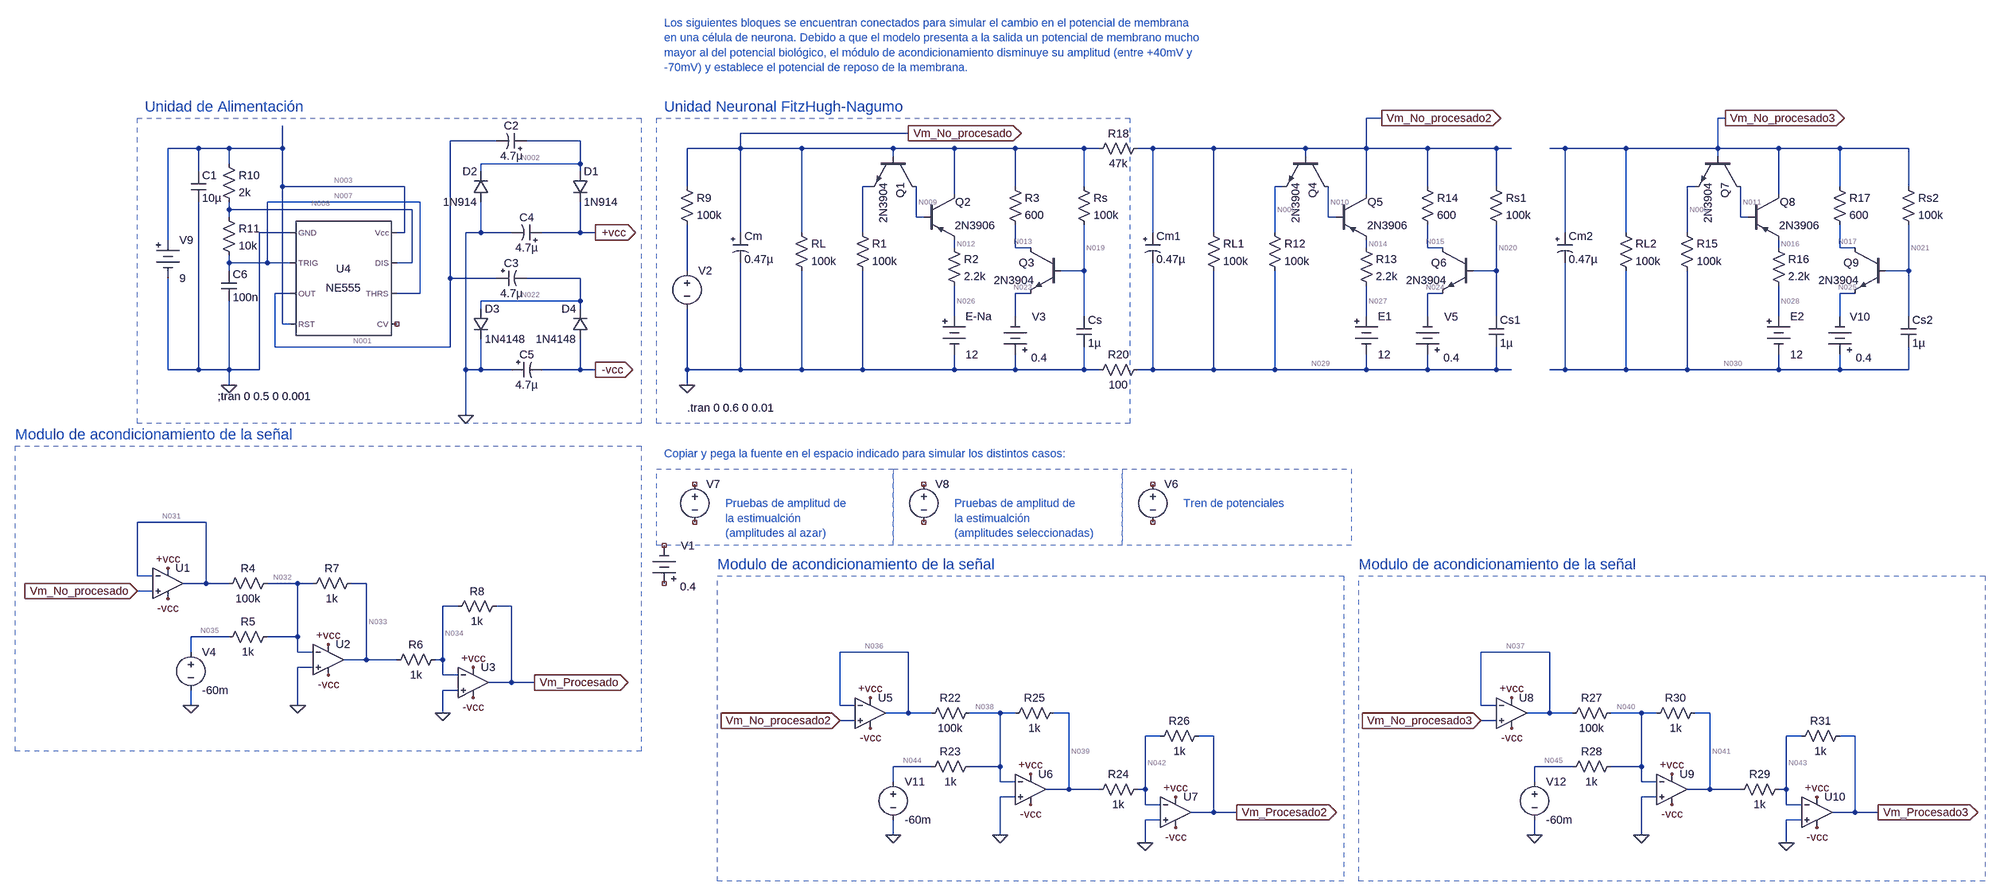
[diagram p0: schematic Pruebas etapas.asc]
Pruebas etapas.asc, the LTspice schematic file:
Version 4
SHEET 1 2580 1348
WIRE 1296 -256 1264 -256
WIRE 2016 -256 2000 -256
WIRE 304 -224 -48 -224
WIRE -560 -208 -656 -208
WIRE -384 -208 -496 -208
WIRE -1184 -192 -1248 -192
WIRE -1120 -192 -1184 -192
WIRE -1008 -192 -1008 -240
WIRE -1008 -192 -1120 -192
WIRE -48 -192 -48 -224
WIRE -48 -192 -160 -192
WIRE 80 -192 -48 -192
WIRE 272 -192 80 -192
WIRE 400 -192 272 -192
WIRE 528 -192 400 -192
WIRE 672 -192 528 -192
WIRE 704 -192 672 -192
WIRE 816 -192 784 -192
WIRE 944 -192 816 -192
WIRE 1136 -192 944 -192
WIRE 1264 -192 1264 -256
WIRE 1264 -192 1136 -192
WIRE 1392 -192 1264 -192
WIRE 1536 -192 1392 -192
WIRE 1568 -192 1536 -192
WIRE 1680 -192 1648 -192
WIRE 1808 -192 1680 -192
WIRE 2000 -192 2000 -256
WIRE 2000 -192 1808 -192
WIRE 2128 -192 2000 -192
WIRE 2256 -192 2128 -192
WIRE 2400 -192 2256 -192
WIRE 272 -176 272 -192
WIRE 1136 -176 1136 -192
WIRE 2000 -176 2000 -192
WIRE -1120 -160 -1120 -192
WIRE -384 -160 -384 -208
WIRE -384 -160 -592 -160
WIRE -1184 -144 -1184 -192
WIRE -592 -144 -592 -160
WIRE -384 -144 -384 -160
WIRE -1008 -112 -1008 -192
WIRE -752 -112 -1008 -112
WIRE -160 -112 -160 -192
WIRE 224 -112 208 -112
WIRE 528 -112 528 -192
WIRE 672 -112 672 -192
WIRE 1088 -112 1072 -112
WIRE 1392 -112 1392 -192
WIRE 1536 -112 1536 -192
WIRE 1952 -112 1936 -112
WIRE 2256 -112 2256 -192
WIRE 2400 -112 2400 -192
WIRE 400 -96 400 -192
WIRE 1264 -96 1264 -192
WIRE 2128 -96 2128 -192
WIRE -720 -80 -1040 -80
WIRE -1120 -64 -1120 -80
WIRE -736 -64 -1120 -64
WIRE -1120 -48 -1120 -64
WIRE 320 -48 320 -112
WIRE 336 -48 320 -48
WIRE 1184 -48 1184 -112
WIRE 1200 -48 1184 -48
WIRE 2048 -48 2048 -112
WIRE 2064 -48 2048 -48
WIRE -992 -16 -1056 -16
WIRE -752 -16 -752 -112
WIRE -752 -16 -768 -16
WIRE -592 -16 -592 -80
WIRE -592 -16 -624 -16
WIRE -528 -16 -592 -16
WIRE -384 -16 -384 -80
WIRE -384 -16 -464 -16
WIRE -352 -16 -384 -16
WIRE -48 -16 -48 -192
WIRE 80 -16 80 -192
WIRE 208 -16 208 -112
WIRE 816 -16 816 -192
WIRE 944 -16 944 -192
WIRE 1072 -16 1072 -112
WIRE 1680 -16 1680 -192
WIRE 1808 -16 1808 -192
WIRE 1936 -16 1936 -112
WIRE -1248 0 -1248 -192
WIRE 400 16 400 0
WIRE 528 16 528 -32
WIRE 560 16 528 16
WIRE 1264 16 1264 0
WIRE 1392 16 1392 -32
WIRE 1424 16 1392 16
WIRE 2128 16 2128 0
WIRE 2256 16 2256 -32
WIRE 2288 16 2256 16
WIRE -1120 48 -1120 32
WIRE -1040 48 -1040 -80
WIRE -1040 48 -1120 48
WIRE -992 48 -1040 48
WIRE -736 48 -736 -64
WIRE -736 48 -768 48
WIRE -1120 64 -1120 48
WIRE -160 64 -160 -32
WIRE 672 64 672 -32
WIRE 672 64 624 64
WIRE 1536 64 1536 -32
WIRE 1536 64 1488 64
WIRE 2400 64 2400 -32
WIRE 2400 64 2352 64
WIRE -656 80 -656 -208
WIRE -560 80 -656 80
WIRE -384 80 -496 80
WIRE -992 112 -1024 112
WIRE -720 112 -720 -80
WIRE -720 112 -768 112
WIRE 560 112 528 112
WIRE 1424 112 1392 112
WIRE 2288 112 2256 112
WIRE -384 128 -384 80
WIRE -384 128 -592 128
WIRE -592 144 -592 128
WIRE -384 144 -384 128
WIRE 400 160 400 96
WIRE 528 160 528 112
WIRE 672 160 672 64
WIRE 1264 160 1264 96
WIRE 1392 160 1392 112
WIRE 1536 160 1536 64
WIRE 2128 160 2128 96
WIRE 2256 160 2256 112
WIRE 2400 160 2400 64
WIRE -1008 176 -1008 -112
WIRE -992 176 -1008 176
WIRE -1024 224 -1024 112
WIRE -656 224 -656 80
WIRE -656 224 -1024 224
WIRE -1248 272 -1248 80
WIRE -1184 272 -1184 -80
WIRE -1184 272 -1248 272
WIRE -1120 272 -1120 128
WIRE -1120 272 -1184 272
WIRE -1056 272 -1056 -16
WIRE -1056 272 -1120 272
WIRE -624 272 -624 -16
WIRE -592 272 -592 208
WIRE -592 272 -624 272
WIRE -528 272 -592 272
WIRE -384 272 -384 208
WIRE -384 272 -464 272
WIRE -352 272 -384 272
WIRE -160 272 -160 144
WIRE -48 272 -48 48
WIRE -48 272 -160 272
WIRE 80 272 80 64
WIRE 80 272 -48 272
WIRE 208 272 208 64
WIRE 208 272 80 272
WIRE 400 272 400 240
WIRE 400 272 208 272
WIRE 528 272 528 240
WIRE 528 272 400 272
WIRE 672 272 672 224
WIRE 672 272 528 272
WIRE 704 272 672 272
WIRE 816 272 816 48
WIRE 816 272 784 272
WIRE 944 272 944 64
WIRE 944 272 816 272
WIRE 1072 272 1072 64
WIRE 1072 272 944 272
WIRE 1264 272 1264 240
WIRE 1264 272 1072 272
WIRE 1392 272 1392 240
WIRE 1392 272 1264 272
WIRE 1536 272 1536 224
WIRE 1536 272 1392 272
WIRE 1568 272 1536 272
WIRE 1680 272 1680 48
WIRE 1680 272 1648 272
WIRE 1808 272 1808 64
WIRE 1808 272 1680 272
WIRE 1936 272 1936 64
WIRE 1936 272 1808 272
WIRE 2128 272 2128 240
WIRE 2128 272 1936 272
WIRE 2256 272 2256 240
WIRE 2256 272 2128 272
WIRE 2400 272 2400 224
WIRE 2400 272 2256 272
WIRE -1120 304 -1120 272
WIRE -160 304 -160 272
WIRE -624 368 -624 272
WIRE -1168 592 -1312 592
WIRE -1312 704 -1312 592
WIRE -1280 704 -1312 704
WIRE -1168 720 -1168 592
WIRE -1168 720 -1216 720
WIRE -1120 720 -1168 720
WIRE -976 720 -1040 720
WIRE -944 720 -976 720
WIRE -832 720 -864 720
WIRE -1280 736 -1312 736
WIRE -640 768 -672 768
WIRE -528 768 -560 768
WIRE -1120 832 -1200 832
WIRE -976 832 -976 720
WIRE -976 832 -1040 832
WIRE -1200 864 -1200 832
WIRE -976 864 -976 832
WIRE -944 864 -976 864
WIRE 304 864 160 864
WIRE 1648 864 1504 864
WIRE -832 880 -832 720
WIRE -832 880 -880 880
WIRE -768 880 -832 880
WIRE -672 880 -672 768
WIRE -672 880 -688 880
WIRE -944 896 -976 896
WIRE -672 912 -672 880
WIRE -640 912 -672 912
WIRE -528 928 -528 768
WIRE -528 928 -576 928
WIRE -480 928 -528 928
WIRE -640 944 -672 944
WIRE -1200 976 -1200 944
WIRE -976 976 -976 896
WIRE 160 976 160 864
WIRE 192 976 160 976
WIRE 1504 976 1504 864
WIRE 1536 976 1504 976
WIRE -672 992 -672 944
WIRE 304 992 304 864
WIRE 304 992 256 992
WIRE 352 992 304 992
WIRE 496 992 432 992
WIRE 528 992 496 992
WIRE 640 992 608 992
WIRE 1648 992 1648 864
WIRE 1648 992 1600 992
WIRE 1696 992 1648 992
WIRE 1840 992 1776 992
WIRE 1872 992 1840 992
WIRE 1984 992 1952 992
WIRE 192 1008 160 1008
WIRE 1536 1008 1504 1008
WIRE 832 1040 800 1040
WIRE 944 1040 912 1040
WIRE 2176 1040 2144 1040
WIRE 2288 1040 2256 1040
WIRE 352 1104 272 1104
WIRE 496 1104 496 992
WIRE 496 1104 432 1104
WIRE 1696 1104 1616 1104
WIRE 1840 1104 1840 992
WIRE 1840 1104 1776 1104
WIRE 272 1136 272 1104
WIRE 496 1136 496 1104
WIRE 528 1136 496 1136
WIRE 1616 1136 1616 1104
WIRE 1840 1136 1840 1104
WIRE 1872 1136 1840 1136
WIRE 640 1152 640 992
WIRE 640 1152 592 1152
WIRE 704 1152 640 1152
WIRE 800 1152 800 1040
WIRE 800 1152 784 1152
WIRE 1984 1152 1984 992
WIRE 1984 1152 1936 1152
WIRE 2048 1152 1984 1152
WIRE 2144 1152 2144 1040
WIRE 2144 1152 2128 1152
WIRE 528 1168 496 1168
WIRE 1872 1168 1840 1168
WIRE 800 1184 800 1152
WIRE 832 1184 800 1184
WIRE 2144 1184 2144 1152
WIRE 2176 1184 2144 1184
WIRE 944 1200 944 1040
WIRE 944 1200 896 1200
WIRE 992 1200 944 1200
WIRE 2288 1200 2288 1040
WIRE 2288 1200 2240 1200
WIRE 2336 1200 2288 1200
WIRE 832 1216 800 1216
WIRE 2176 1216 2144 1216
WIRE 272 1248 272 1216
WIRE 496 1248 496 1168
WIRE 1616 1248 1616 1216
WIRE 1840 1248 1840 1168
WIRE 800 1264 800 1216
WIRE 2144 1264 2144 1216
FLAG -160 304 0
FLAG -1248 688 +vcc
FLAG -1248 752 -vcc
FLAG -976 976 0
FLAG -1200 976 0
FLAG -912 912 -vcc
FLAG -912 848 +vcc
FLAG -608 960 -vcc
FLAG -608 896 +vcc
FLAG -672 992 0
FLAG -480 928 Vm_Procesado
IOPIN -480 928 Out
FLAG -1312 736 Vm_No_procesado
IOPIN -1312 736 In
FLAG 304 -224 Vm_No_procesado
IOPIN 304 -224 Out
FLAG -1120 304 0
FLAG -352 -16 +vcc
IOPIN -352 -16 Out
FLAG -624 368 0
FLAG -352 272 -vcc
IOPIN -352 272 Out
FLAG 224 960 +vcc
FLAG 224 1024 -vcc
FLAG 496 1248 0
FLAG 272 1248 0
FLAG 560 1184 -vcc
FLAG 560 1120 +vcc
FLAG 864 1232 -vcc
FLAG 864 1168 +vcc
FLAG 800 1264 0
FLAG 992 1200 Vm_Procesado2
IOPIN 992 1200 Out
FLAG 160 1008 Vm_No_procesado2
IOPIN 160 1008 In
FLAG 1568 960 +vcc
FLAG 1568 1024 -vcc
FLAG 1840 1248 0
FLAG 1616 1248 0
FLAG 1904 1184 -vcc
FLAG 1904 1120 +vcc
FLAG 2208 1232 -vcc
FLAG 2208 1168 +vcc
FLAG 2144 1264 0
FLAG 2336 1200 Vm_Procesado3
IOPIN 2336 1200 Out
FLAG 1504 1008 Vm_No_procesado3
IOPIN 1504 1008 In
FLAG 1296 -256 Vm_No_procesado2
IOPIN 1296 -256 Out
FLAG 2016 -256 Vm_No_procesado3
IOPIN 2016 -256 Out
SYMBOL res 64 -32 R0
SYMATTR InstName RL
SYMATTR Value 100k
SYMBOL res 192 -32 R0
SYMATTR InstName R1
SYMATTR Value 100k
SYMBOL res 384 0 R0
SYMATTR InstName R2
SYMATTR Value 2.2k
SYMBOL res 656 -128 R0
SYMATTR InstName Rs
SYMATTR Value 100k
SYMBOL cap 656 160 R0
SYMATTR InstName Cs
SYMATTR Value 1µ
SYMATTR SpiceLine V=16
SYMBOL npn 320 -176 R90
SYMATTR InstName Q1
SYMATTR Value 2N3904
SYMBOL pnp 336 -96 R0
WINDOW 0 66 16 Left 2
WINDOW 3 65 65 Left 2
SYMATTR InstName Q2
SYMATTR Value 2N3906
SYMBOL Misc\\battery -208 736 R180
WINDOW 0 -64 95 Left 2
WINDOW 3 -67 9 Left 2
WINDOW 123 0 0 Left 0
WINDOW 39 0 0 Left 0
SYMATTR InstName V1
SYMATTR Value 0.4
SYMBOL Misc\\battery 400 144 R0
WINDOW 123 0 0 Left 0
WINDOW 39 0 0 Left 0
SYMATTR InstName E-Na
SYMATTR Value 12
SYMBOL npn 624 16 M0
SYMATTR InstName Q3
SYMATTR Value 2N3904
SYMBOL polcap -64 -16 R0
SYMATTR InstName Cm
SYMATTR Value 0.47µ
SYMATTR SpiceLine V=16
SYMBOL res 512 -128 R0
SYMATTR InstName R3
SYMATTR Value 600
SYMBOL OpAmps\\UniversalOpAmp -1248 720 R0
SYMATTR InstName U1
SYMBOL OpAmps\\UniversalOpAmp -912 880 R0
SYMATTR InstName U2
SYMBOL OpAmps\\UniversalOpAmp -608 928 R0
SYMATTR InstName U3
SYMBOL res -1024 704 R90
WINDOW 0 0 56 VBottom 2
WINDOW 3 32 56 VTop 2
SYMATTR InstName R4
SYMATTR Value 100k
SYMBOL res -1024 816 R90
WINDOW 0 0 56 VBottom 2
WINDOW 3 32 56 VTop 2
SYMATTR InstName R5
SYMATTR Value 1k
SYMBOL res -672 864 R90
WINDOW 0 0 56 VBottom 2
WINDOW 3 32 56 VTop 2
SYMATTR InstName R6
SYMATTR Value 1k
SYMBOL res -848 704 R90
WINDOW 0 0 56 VBottom 2
WINDOW 3 32 56 VTop 2
SYMATTR InstName R7
SYMATTR Value 1k
SYMBOL res -544 752 R90
WINDOW 0 0 56 VBottom 2
WINDOW 3 32 56 VTop 2
SYMATTR InstName R8
SYMATTR Value 1k
SYMBOL voltage -1200 848 R0
WINDOW 123 0 0 Left 0
WINDOW 39 0 0 Left 0
SYMATTR InstName V4
SYMATTR Value -60m
SYMBOL res -176 -128 R0
SYMATTR InstName R9
SYMATTR Value 100k
SYMBOL voltage -144 496 R0
WINDOW 123 0 0 Left 0
WINDOW 39 0 0 Left 0
WINDOW 3 24 44 Invisible 2
SYMATTR Value PWL(0 0 5m 0 5.0000001m 0.5 15m 0.5 15.000001m 0 40m 0 40.000001m 1 70m 1 70.00001m 0 130m 0 130.00001m 2 150m 2 150.00001m 0 190m 0 190.00001m 3 200m 3 200.00001m 0 240m 0 240.00001m 5 250m 5 250.00001m 0 290m 0 290.00001m 5 330m 5 330.00001m 0 350m 0 350.00001m 5 400m 5 400.00001m 0 430m 0 430.00001m 7 450m 7 450.00001m 0 480m 0 480.00001m 7 520m 7 520.00001m 0 550m 0 550.00001m 1 610m 1 610.00001m 0 700m 0 700.00001m 0.5 760m 0.5 760.00001m 0 780m 0 780.00001m 1 870.m 1 870.00001m 0)
SYMATTR InstName V7
SYMBOL voltage 336 496 R0
WINDOW 123 0 0 Left 0
WINDOW 39 0 0 Left 0
WINDOW 3 24 44 Invisible 2
SYMATTR Value PWL(0 0 5m 0 5.0000001m 0.5 15m 0.5 15.000001m 0 70m 0 70.000001m 1 80m 1 80.000001m 0 135m 0 135.000001m 2 145m 2 145.000001m 0 200m 0 200.000001m 3 210m 3 210.000001m 0 265m 0 265.000001m 4 275m 4 275.000001m 0 330m 0 330.00001m 5 340m 5 340.000001m 0)
SYMATTR InstName V8
SYMBOL voltage 816 496 R0
WINDOW 3 -35 356 Invisible 2
WINDOW 123 0 0 Left 0
WINDOW 39 0 0 Left 0
SYMATTR Value PULSE(0 5 0 1f 1f 10m 50m)
SYMATTR InstName V6
SYMBOL Misc\\NE555 -880 80 R0
SYMATTR InstName U4
SYMBOL res -1136 -176 R0
SYMATTR InstName R10
SYMATTR Value 2k
SYMBOL res -1136 -64 R0
SYMATTR InstName R11
SYMATTR Value 10k
SYMBOL cap -1200 -144 R0
SYMATTR InstName C1
SYMATTR Value 10µ
SYMBOL polcap -496 -192 M270
WINDOW 0 32 32 VTop 2
WINDOW 3 0 32 VBottom 2
SYMATTR InstName C2
SYMATTR Value 4.7µ
SYMBOL polcap -560 64 M90
WINDOW 0 0 32 VBottom 2
WINDOW 3 32 32 VTop 2
SYMATTR InstName C3
SYMATTR Value 4.7µ
SYMBOL polcap -464 0 M270
WINDOW 0 32 32 VTop 2
WINDOW 3 0 32 VBottom 2
SYMATTR InstName C4
SYMATTR Value 4.7µ
SYMBOL polcap -528 256 M90
WINDOW 0 0 32 VBottom 2
WINDOW 3 32 32 VTop 2
SYMATTR InstName C5
SYMATTR Value 4.7µ
SYMBOL diode -400 -144 R0
SYMATTR InstName D1
SYMATTR Value 1N914
SYMBOL diode -576 -80 R180
WINDOW 0 24 64 Left 2
WINDOW 3 24 0 Left 2
SYMATTR InstName D2
SYMATTR Value 1N914
SYMBOL diode -608 144 R0
SYMATTR InstName D3
SYMATTR Value 1N4148
SYMBOL diode -368 208 R180
WINDOW 0 24 64 Left 2
WINDOW 3 24 0 Left 2
SYMATTR InstName D4
SYMATTR Value 1N4148
SYMBOL cap -1136 64 R0
SYMATTR InstName C6
SYMATTR Value 100n
SYMBOL Misc\\battery -1248 -16 R0
WINDOW 123 0 0 Left 0
WINDOW 39 0 0 Left 0
SYMATTR InstName V9
SYMATTR Value 9
SYMBOL Misc\\battery 528 256 R180
WINDOW 0 -64 95 Left 2
WINDOW 3 -67 9 Left 2
WINDOW 123 0 0 Left 0
WINDOW 39 0 0 Left 0
SYMATTR InstName V3
SYMATTR Value 0.4
SYMBOL voltage -160 48 R0
WINDOW 3 -35 356 Invisible 2
WINDOW 123 0 0 Left 0
WINDOW 39 0 0 Left 0
SYMATTR Value PULSE(0 5 0 1f 1f 10m 50m)
SYMATTR InstName V2
SYMBOL res 928 -32 R0
SYMATTR InstName RL1
SYMATTR Value 100k
SYMBOL res 1056 -32 R0
SYMATTR InstName R12
SYMATTR Value 100k
SYMBOL res 1248 0 R0
SYMATTR InstName R13
SYMATTR Value 2.2k
SYMBOL res 1520 -128 R0
SYMATTR InstName Rs1
SYMATTR Value 100k
SYMBOL cap 1520 160 R0
SYMATTR InstName Cs1
SYMATTR Value 1µ
SYMATTR SpiceLine V=0.1v
SYMBOL npn 1184 -176 R90
SYMATTR InstName Q4
SYMATTR Value 2N3904
SYMBOL pnp 1200 -96 R0
WINDOW 0 66 16 Left 2
WINDOW 3 65 65 Left 2
SYMATTR InstName Q5
SYMATTR Value 2N3906
SYMBOL Misc\\battery 1264 144 R0
WINDOW 123 0 0 Left 0
WINDOW 39 0 0 Left 0
SYMATTR InstName E1
SYMATTR Value 12
SYMBOL npn 1488 16 M0
SYMATTR InstName Q6
SYMATTR Value 2N3904
SYMBOL polcap 800 -16 R0
SYMATTR InstName Cm1
SYMATTR Value 0.47µ
SYMATTR SpiceLine V=16
SYMBOL res 1376 -128 R0
SYMATTR InstName R14
SYMATTR Value 600
SYMBOL Misc\\battery 1392 256 R180
WINDOW 0 -64 95 Left 2
WINDOW 3 -67 9 Left 2
WINDOW 123 0 0 Left 0
WINDOW 39 0 0 Left 0
SYMATTR InstName V5
SYMATTR Value 0.4
SYMBOL res 1792 -32 R0
SYMATTR InstName RL2
SYMATTR Value 100k
SYMBOL res 1920 -32 R0
SYMATTR InstName R15
SYMATTR Value 100k
SYMBOL res 2112 0 R0
SYMATTR InstName R16
SYMATTR Value 2.2k
SYMBOL res 2384 -128 R0
SYMATTR InstName Rs2
SYMATTR Value 100k
SYMBOL cap 2384 160 R0
SYMATTR InstName Cs2
SYMATTR Value 1µ
SYMATTR SpiceLine V=0.1v
SYMBOL npn 2048 -176 R90
SYMATTR InstName Q7
SYMATTR Value 2N3904
SYMBOL pnp 2064 -96 R0
WINDOW 0 66 16 Left 2
WINDOW 3 65 65 Left 2
SYMATTR InstName Q8
SYMATTR Value 2N3906
SYMBOL Misc\\battery 2128 144 R0
WINDOW 123 0 0 Left 0
WINDOW 39 0 0 Left 0
SYMATTR InstName E2
SYMATTR Value 12
SYMBOL npn 2352 16 M0
SYMATTR InstName Q9
SYMATTR Value 2N3904
SYMBOL polcap 1664 -16 R0
SYMATTR InstName Cm2
SYMATTR Value 0.47µ
SYMATTR SpiceLine V=16
SYMBOL res 2240 -128 R0
SYMATTR InstName R17
SYMATTR Value 600
SYMBOL Misc\\battery 2256 256 R180
WINDOW 0 -64 95 Left 2
WINDOW 3 -67 9 Left 2
WINDOW 123 0 0 Left 0
WINDOW 39 0 0 Left 0
SYMATTR InstName V10
SYMATTR Value 0.4
SYMBOL res 800 -208 R90
WINDOW 0 0 56 VBottom 2
WINDOW 3 32 56 VTop 2
SYMATTR InstName R18
SYMATTR Value 47k
SYMBOL res 800 256 R90
WINDOW 0 0 56 VBottom 2
WINDOW 3 32 56 VTop 2
SYMATTR InstName R20
SYMATTR Value 100
SYMBOL OpAmps\\UniversalOpAmp 224 992 R0
SYMATTR InstName U5
SYMBOL OpAmps\\UniversalOpAmp 560 1152 R0
SYMATTR InstName U6
SYMBOL OpAmps\\UniversalOpAmp 864 1200 R0
SYMATTR InstName U7
SYMBOL res 448 976 R90
WINDOW 0 0 56 VBottom 2
WINDOW 3 32 56 VTop 2
SYMATTR InstName R22
SYMATTR Value 100k
SYMBOL res 448 1088 R90
WINDOW 0 0 56 VBottom 2
WINDOW 3 32 56 VTop 2
SYMATTR InstName R23
SYMATTR Value 1k
SYMBOL res 800 1136 R90
WINDOW 0 0 56 VBottom 2
WINDOW 3 32 56 VTop 2
SYMATTR InstName R24
SYMATTR Value 1k
SYMBOL res 624 976 R90
WINDOW 0 0 56 VBottom 2
WINDOW 3 32 56 VTop 2
SYMATTR InstName R25
SYMATTR Value 1k
SYMBOL res 928 1024 R90
WINDOW 0 0 56 VBottom 2
WINDOW 3 32 56 VTop 2
SYMATTR InstName R26
SYMATTR Value 1k
SYMBOL voltage 272 1120 R0
WINDOW 123 0 0 Left 0
WINDOW 39 0 0 Left 0
SYMATTR InstName V11
SYMATTR Value -60m
SYMBOL OpAmps\\UniversalOpAmp 1568 992 R0
SYMATTR InstName U8
SYMBOL OpAmps\\UniversalOpAmp 1904 1152 R0
SYMATTR InstName U9
SYMBOL OpAmps\\UniversalOpAmp 2208 1200 R0
SYMATTR InstName U10
SYMBOL res 1792 976 R90
WINDOW 0 0 56 VBottom 2
WINDOW 3 32 56 VTop 2
SYMATTR InstName R27
SYMATTR Value 100k
SYMBOL res 1792 1088 R90
WINDOW 0 0 56 VBottom 2
WINDOW 3 32 56 VTop 2
SYMATTR InstName R28
SYMATTR Value 1k
SYMBOL res 2144 1136 R90
WINDOW 0 0 56 VBottom 2
WINDOW 3 32 56 VTop 2
SYMATTR InstName R29
SYMATTR Value 1k
SYMBOL res 1968 976 R90
WINDOW 0 0 56 VBottom 2
WINDOW 3 32 56 VTop 2
SYMATTR InstName R30
SYMATTR Value 1k
SYMBOL res 2272 1024 R90
WINDOW 0 0 56 VBottom 2
WINDOW 3 32 56 VTop 2
SYMATTR InstName R31
SYMATTR Value 1k
SYMBOL voltage 1616 1120 R0
WINDOW 123 0 0 Left 0
WINDOW 39 0 0 Left 0
SYMATTR InstName V12
SYMATTR Value -60m
TEXT -160 352 Left 2 !.tran 0 0.6 0 0.01
TEXT -208 -280 Left 3 ;Unidad Neuronal FitzHugh-Nagumo
TEXT -1568 408 Left 3 ;Modulo de acondicionamiento de la señal
TEXT -208 -456 Left 2 ;Los siguientes bloques se encuentran conectados para simular el cambio en el potencial de membrana\nen una célula de neurona. Debido a que el modelo presenta a la salida un potencial de membrano mucho\nmayor al del potencial biológico, el módulo de acondicionamiento disminuye su amplitud (entre +40mV y \n-70mV) y establece el potencial de reposo de la membrana.
TEXT -80 552 Left 2 ;Pruebas de amplitud de \nla estimualción\n(amplitudes al azar)
TEXT 400 552 Left 2 ;Pruebas de amplitud de \nla estimualción\n(amplitudes seleccionadas)
TEXT -208 448 Left 2 ;Copiar y pega la fuente en el espacio indicado para simular los distintos casos:
TEXT 880 552 Left 2 ;Tren de potenciales
TEXT -1144 328 Left 2 !;tran 0 0.5 0 0.001
TEXT -1296 -280 Left 3 ;Unidad de Alimentación
TEXT -96 680 Left 3 ;Modulo de acondicionamiento de la señal
TEXT 1248 680 Left 3 ;Modulo de acondicionamiento de la señal
RECTANGLE Normal 768 384 -224 -256 2
RECTANGLE Normal -256 1072 -1568 432 2
RECTANGLE Normal 272 640 -224 480 2
RECTANGLE Normal 752 640 272 480 2
RECTANGLE Normal 1232 640 752 480 2
RECTANGLE Normal -256 384 -1312 -256 2
RECTANGLE Normal 1216 1344 -96 704 2
RECTANGLE Normal 2560 1344 1248 704 2

The netlist it stands for:
* Pruebas etapas.asc
RL Vm_No_procesado 0 100k
R1 N004 0 100k
R2 N012 N026 2.2k
Rs Vm_No_procesado N019 100k
Cs N019 0 1µ V=16
Q1 N009 Vm_No_procesado N004 0 2N3904
Q2 Vm_No_procesado N009 N012 0 2N3906
V1 NC_01 NC_02 0.4
V§E-Na N026 0 12
Q3 N013 N019 N023 0 2N3904
Cm Vm_No_procesado 0 0.47µ V=16
R3 Vm_No_procesado N013 600
XU1 Vm_No_procesado N031 +vcc -vcc N031 level1 Avol=1Meg GBW=10Meg Vos=0 En=0 Enk=0 In=0 Ink=0 Rin=500Meg  ; pins In+ In- V+ V- OUT
XU2 0 N032 +vcc -vcc N033 level1 Avol=1Meg GBW=10Meg Vos=0 En=0 Enk=0 In=0 Ink=0 Rin=500Meg  ; pins In+ In- V+ V- OUT
XU3 0 N034 +vcc -vcc Vm_Procesado level1 Avol=1Meg GBW=10Meg Vos=0 En=0 Enk=0 In=0 Ink=0 Rin=500Meg  ; pins In+ In- V+ V- OUT
R4 N032 N031 100k
R5 N032 N035 1k
R6 N034 N033 1k
R7 N033 N032 1k
R8 Vm_Procesado N034 1k
V4 N035 0 -60m
R9 Vm_No_procesado N018 100k
V7 NC_03 NC_04 PWL(0 0 5m 0 5.0000001m 0.5 15m 0.5 15.000001m 0 40m 0 40.000001m 1 70m 1 70.00001m 0 130m 0 130.00001m 2 150m 2 150.00001m 0 190m 0 190.00001m 3 200m 3 200.00001m 0 240m 0 240.00001m 5 250m 5 250.00001m 0 290m 0 290.00001m 5 330m 5 330.00001m 0 350m 0 350.00001m 5 400m 5 400.00001m 0 430m 0 430.00001m 7 450m 7 450.00001m 0 480m 0 480.00001m 7 520m 7 520.00001m 0 550m 0 550.00001m 1 610m 1 610.00001m 0 700m 0 700.00001m 0.5 760m 0.5 760.00001m 0 780m 0 780.00001m 1 870.m 1 870.00001m 0)
V8 NC_05 NC_06 PWL(0 0 5m 0 5.0000001m 0.5 15m 0.5 15.000001m 0 70m 0 70.000001m 1 80m 1 80.000001m 0 135m 0 135.000001m 2 145m 2 145.000001m 0 200m 0 200.000001m 3 210m 3 210.000001m 0 265m 0 265.000001m 4 275m 4 275.000001m 0 330m 0 330.00001m 5 340m 5 340.000001m 0)
V6 NC_07 NC_08 PULSE(0 5 0 1f 1f 10m 50m)
XU4 0 N007 N001 N003 NC_09 N007 N008 N003 NE555  ; pins GND TRIG OUT RST CV THRS DIS Vcc
R10 N003 N008 2k
R11 N008 N007 10k
C1 N003 0 10µ
C2 N002 N001 4.7µ
C3 N001 N022 4.7µ
C4 +vcc 0 4.7µ
C5 0 -vcc 4.7µ
D1 N002 +vcc 1N914
D2 0 N002 1N914
D3 N022 0 1N4148
D4 -vcc N022 1N4148
C6 N007 0 100n
V9 N003 0 9
V3 0 N023 0.4
V2 N018 0 PULSE(0 5 0 1f 1f 10m 50m)
RL1 Vm_No_procesado2 N029 100k
R12 N005 N029 100k
R13 N014 N027 2.2k
Rs1 Vm_No_procesado2 N020 100k
Cs1 N020 N029 1µ V=0.1v
Q4 N010 Vm_No_procesado2 N005 0 2N3904
Q5 Vm_No_procesado2 N010 N014 0 2N3906
V§E1 N027 N029 12
Q6 N015 N020 N024 0 2N3904
Cm1 Vm_No_procesado2 N029 0.47µ V=16
R14 Vm_No_procesado2 N015 600
V5 N029 N024 0.4
RL2 Vm_No_procesado3 N030 100k
R15 N006 N030 100k
R16 N016 N028 2.2k
Rs2 Vm_No_procesado3 N021 100k
Cs2 N021 N030 1µ V=0.1v
Q7 N011 Vm_No_procesado3 N006 0 2N3904
Q8 Vm_No_procesado3 N011 N016 0 2N3906
V§E2 N028 N030 12
Q9 N017 N021 N025 0 2N3904
Cm2 Vm_No_procesado3 N030 0.47µ V=16
R17 Vm_No_procesado3 N017 600
V10 N030 N025 0.4
R18 Vm_No_procesado2 Vm_No_procesado 47k
R20 N029 0 100
XU5 Vm_No_procesado2 N036 +vcc -vcc N036 level1 Avol=1Meg GBW=10Meg Vos=0 En=0 Enk=0 In=0 Ink=0 Rin=500Meg  ; pins In+ In- V+ V- OUT
XU6 0 N038 +vcc -vcc N039 level1 Avol=1Meg GBW=10Meg Vos=0 En=0 Enk=0 In=0 Ink=0 Rin=500Meg  ; pins In+ In- V+ V- OUT
XU7 0 N042 +vcc -vcc Vm_Procesado2 level1 Avol=1Meg GBW=10Meg Vos=0 En=0 Enk=0 In=0 Ink=0 Rin=500Meg  ; pins In+ In- V+ V- OUT
R22 N038 N036 100k
R23 N038 N044 1k
R24 N042 N039 1k
R25 N039 N038 1k
R26 Vm_Procesado2 N042 1k
V11 N044 0 -60m
XU8 Vm_No_procesado3 N037 +vcc -vcc N037 level1 Avol=1Meg GBW=10Meg Vos=0 En=0 Enk=0 In=0 Ink=0 Rin=500Meg  ; pins In+ In- V+ V- OUT
XU9 0 N040 +vcc -vcc N041 level1 Avol=1Meg GBW=10Meg Vos=0 En=0 Enk=0 In=0 Ink=0 Rin=500Meg  ; pins In+ In- V+ V- OUT
XU10 0 N043 +vcc -vcc Vm_Procesado3 level1 Avol=1Meg GBW=10Meg Vos=0 En=0 Enk=0 In=0 Ink=0 Rin=500Meg  ; pins In+ In- V+ V- OUT
R27 N040 N037 100k
R28 N040 N045 1k
R29 N043 N041 1k
R30 N041 N040 1k
R31 Vm_Procesado3 N043 1k
V12 N045 0 -60m
.model D D
.lib standard.dio
.model NPN NPN
.model PNP PNP
.lib standard.bjt
.tran 0 0.6 0 0.01
* Unidad Neuronal FitzHugh-Nagumo
* Modulo de acondicionamiento de la señal
* Los siguientes bloques se encuentran conectados para simular el cambio en el potencial de membrana
* en una célula de neurona. Debido a que el modelo presenta a la salida un potencial de membrano mucho
* mayor al del potencial biológico, el módulo de acondicionamiento disminuye su amplitud (entre +40mV y
* -70mV) y establece el potencial de reposo de la membrana.
* Pruebas de amplitud de
* la estimualción
* (amplitudes al azar)
* Pruebas de amplitud de
* la estimualción
* (amplitudes seleccionadas)
* Copiar y pega la fuente en el espacio indicado para simular los distintos casos:
* Tren de potenciales
;tran 0 0.5 0 0.001
* Unidad de Alimentación
* Modulo de acondicionamiento de la señal
* Modulo de acondicionamiento de la señal
.lib UniversalOpAmp1.lib
.lib NE555.sub
.backanno
.end

* Results of the author's LTspice run, read from the files saved beside the schematic
* Operating Point, zero values left out:
*   V(vm_no_procesado) = -2.611 mV
*   V(n012) = 12 V
*   V(n026) = 12 V
*   V(n019) = -2.627 mV
*   V(n009) = 11.66 V
*   V(n013) = -2.639 mV
*   V(n023) = -400 mV
*   V(n031) = -2.611 mV
*   V(+vcc) = -260.1 µV
*   V(-vcc) = -260.6 µV
*   V(n032) = -60.04 nV
*   V(n033) = 60.03 mV
*   V(n034) = 60.03 nV
*   V(vm_procesado) = -60.03 mV
*   V(n035) = -60 mV
*   V(n007) = 9 V
*   V(n003) = 9 V
*   V(n008) = 9 V
*   V(n001) = 9 V
*   V(n002) = -130.1 µV
*   V(n022) = -130.3 µV
*   V(vm_no_procesado2) = -3.091 mV
*   V(n029) = 1.022 µV
*   V(n005) = 1.023 µV
*   V(n014) = 12 V
*   V(n027) = 12 V
*   V(n020) = -3.106 mV
*   V(n010) = 11.66 V
*   V(n015) = -3.119 mV
*   V(n024) = -400 mV
*   V(vm_no_procesado3) = -261 µV
*   V(n030) = 3.7 mV
*   V(n006) = 3.7 mV
*   V(n016) = 12 V
*   V(n028) = 12 V
*   V(n021) = -275.9 µV
*   V(n011) = 11.67 V
*   V(n017) = -287.8 µV
*   V(n025) = -396.3 mV
*   V(n036) = -3.091 mV
*   V(n038) = -60.04 nV
*   V(n039) = 60.03 mV
*   V(n042) = 60.04 nV
*   V(vm_procesado2) = -60.03 mV
*   V(n044) = -60 mV
*   V(n037) = -261 µV
*   V(n040) = -60.01 nV
*   V(n041) = 60 mV
*   V(n043) = 60.01 nV
*   V(vm_procesado3) = -60 mV
*   V(n045) = -60 mV
*   Ic(Q8) = -5.153 nA
*   Ib(Q8) = -11.69 pA
*   Ie(Q8) = 5.165 nA
*   Ic(Q5) = -5.153 nA
*   Ib(Q5) = -11.69 pA
*   Ie(Q5) = 5.164 nA
*   Ic(Q2) = -5.151 nA
*   Ib(Q2) = -11.68 pA
*   Ie(Q2) = 5.163 nA
*   Ic(Q9) = 44.63 nA
*   Ib(Q9) = 149.1 pA
*   Ie(Q9) = -44.77 nA
*   Ic(Q7) = 11.67 pA
*   Ib(Q7) = -11.67 pA
*   Ic(Q6) = 46.15 nA
*   Ib(Q6) = 154.2 pA
*   Ie(Q6) = -46.3 nA
*   Ic(Q4) = 11.67 pA
*   Ib(Q4) = -11.67 pA
*   Ic(Q3) = 47.01 nA
*   Ib(Q3) = 157.1 pA
*   Ie(Q3) = -47.17 nA
*   Ic(Q1) = 11.67 pA
*   Ib(Q1) = -11.67 pA
*   I(D4) = -7.235 pA
*   I(D3) = -7.235 pA
*   I(D2) = 7.243 pA
*   I(D1) = 7.243 pA
*   I(R31) = -60 µA
*   I(R30) = 60 µA
*   I(R29) = -60 µA
*   I(R28) = 60 µA
*   I(R27) = 2.609 nA
*   I(R26) = -60.03 µA
*   I(R25) = 60.03 µA
*   I(R24) = -60.03 µA
*   I(R23) = 60 µA
*   I(R22) = 30.91 nA
*   I(R20) = 10.22 nA
*   I(R18) = -10.21 nA
*   I(R17) = 44.63 nA
*   I(Rs2) = 149.1 pA
*   I(R16) = -5.165 nA
*   I(Rl2) = -39.61 nA
*   I(R14) = 46.15 nA
*   I(Rs1) = 154.2 pA
*   I(R13) = -5.164 nA
*   I(Rl1) = -30.92 nA
*   I(R11) = 18 nA
*   I(R10) = 30.01 nA
*   I(R9) = -26.11 nA
*   I(R8) = -60.03 µA
*   I(R7) = 60.03 µA
*   I(R6) = -60.03 µA
*   I(R5) = 60 µA
*   I(R4) = 26.11 nA
*   I(R3) = 47.01 nA
*   I(Rs) = 157.1 pA
*   I(R2) = -5.163 nA
*   I(Rl) = -26.11 nA
*   I(V12) = 60 µA
*   I(V11) = 60 µA
*   I(V10) = -44.77 nA
*   I(E2) = -5.165 nA
*   I(V5) = -46.3 nA
*   I(E1) = -5.164 nA
*   I(V2) = -26.11 nA
*   I(V3) = -47.17 nA
*   I(V9) = -2.908 mA
*   I(V4) = 60 µA
*   I(E-na) = -5.163 nA